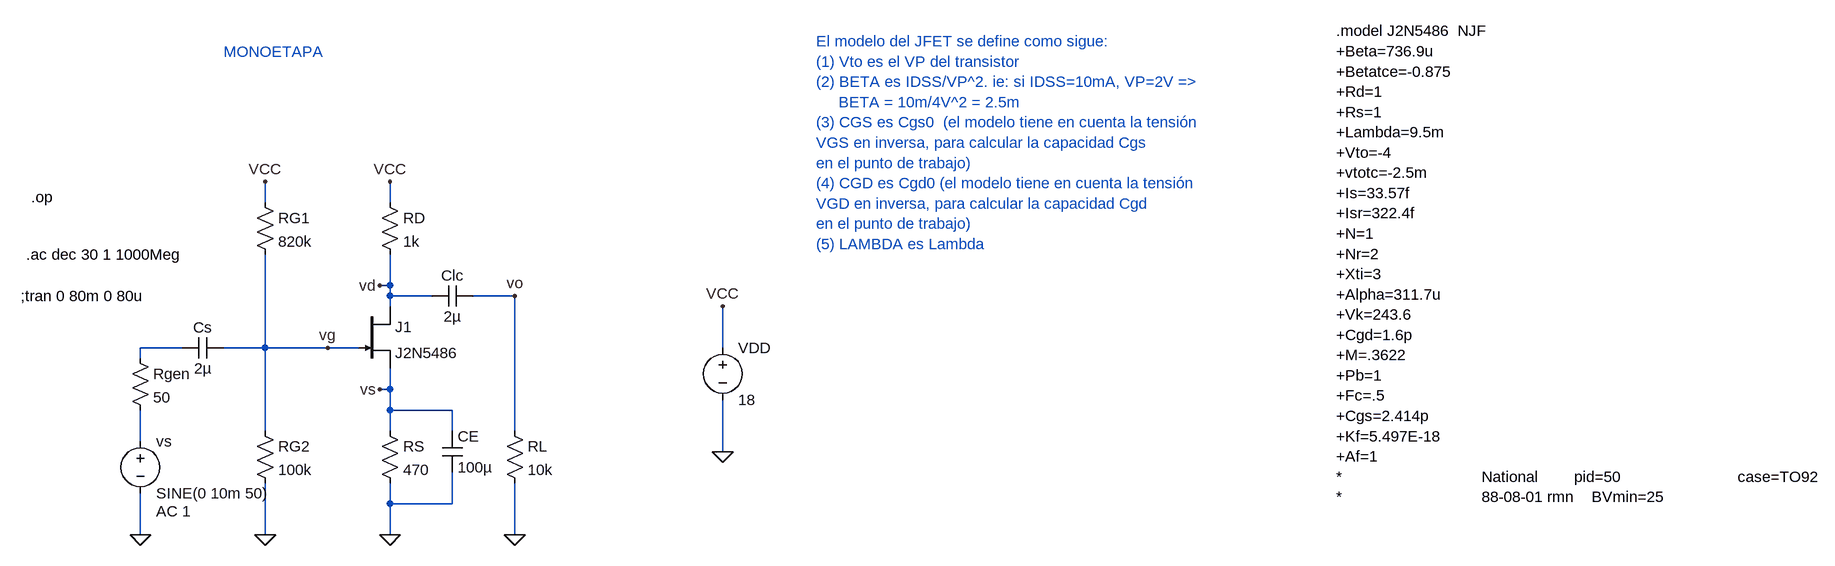
[diagram p0: schematic JFETN.asc]
JFETN.asc, the LTspice schematic file:
Version 4
SHEET 1 4420 924
WIRE 16 64 16 32
WIRE 208 64 208 32
WIRE 208 192 208 144
WIRE 208 192 192 192
WIRE 208 208 208 192
WIRE 272 208 208 208
WIRE 400 208 336 208
WIRE 208 224 208 208
WIRE -112 288 -176 288
WIRE 16 288 16 144
WIRE 16 288 -48 288
WIRE 112 288 16 288
WIRE 160 288 112 288
WIRE 720 288 720 224
WIRE -176 304 -176 288
WIRE 208 352 208 320
WIRE 208 352 192 352
WIRE 208 384 208 352
WIRE 304 384 208 384
WIRE 16 416 16 288
WIRE 208 416 208 384
WIRE 304 416 304 384
WIRE 400 416 400 208
WIRE -176 432 -176 384
WIRE 720 448 720 368
WIRE 208 528 208 496
WIRE 304 528 304 480
WIRE 304 528 208 528
WIRE -176 576 -176 512
WIRE 16 576 16 496
WIRE 208 576 208 528
WIRE 400 576 400 496
FLAG 112 288 vg
FLAG 192 352 vs
FLAG 192 192 vd
FLAG 16 576 0
FLAG 208 576 0
FLAG 400 576 0
FLAG 16 32 VCC
FLAG 208 32 VCC
FLAG 720 224 VCC
FLAG 720 448 0
FLAG -176 576 0
FLAG 400 208 vo
SYMBOL njf 160 224 R0
SYMATTR InstName J1
SYMATTR Value J2N5486
SYMBOL res 192 48 R0
SYMATTR InstName RD
SYMATTR Value 1k
SYMBOL res 192 400 R0
SYMATTR InstName RS
SYMATTR Value 470
SYMBOL res 0 48 R0
SYMATTR InstName RG1
SYMATTR Value 820k
SYMBOL res 0 400 R0
SYMATTR InstName RG2
SYMATTR Value 100k
SYMBOL cap 336 192 R90
WINDOW 0 0 32 VBottom 2
WINDOW 3 32 32 VTop 2
SYMATTR InstName Clc
SYMATTR Value 2µ
SYMBOL cap -48 272 R90
WINDOW 0 0 32 VBottom 2
WINDOW 3 32 32 VTop 2
SYMATTR InstName Cs
SYMATTR Value 2µ
SYMBOL res 384 400 R0
SYMATTR InstName RL
SYMATTR Value 10k
SYMBOL voltage 720 272 R0
SYMATTR InstName VDD
SYMATTR Value 18
SYMBOL voltage -176 416 R0
WINDOW 123 24 124 Left 2
WINDOW 39 0 0 Left 0
SYMATTR Value2 AC 1
SYMATTR InstName vs
SYMATTR Value SINE(0 10m 50)
SYMBOL cap 288 416 R0
SYMATTR InstName CE
SYMATTR Value 100µ
SYMBOL res -192 288 R0
SYMATTR InstName Rgen
SYMATTR Value 50
TEXT 864 -184 Left 2 ;El modelo del JFET se define como sigue:\n(1) Vto es el VP del transistor\n(2) BETA es IDSS/VP^2. ie: si IDSS=10mA, VP=2V =>\n     BETA = 10m/4V^2 = 2.5m\n(3) CGS es Cgs0  (el modelo tiene en cuenta la tensión \nVGS en inversa, para calcular la capacidad Cgs \nen el punto de trabajo)\n(4) CGD es Cgd0 (el modelo tiene en cuenta la tensión \nVGD en inversa, para calcular la capacidad Cgd \nen el punto de trabajo)\n(5) LAMBDA es Lambda
TEXT 1664 -200 Left 2 !.model J2N5486  NJF\n+Beta=736.9u\n+Betatce=-0.875\n+Rd=1\n+Rs=1\n+Lambda=9.5m\n+Vto=-4\n+vtotc=-2.5m\n+Is=33.57f\n+Isr=322.4f\n+N=1\n+Nr=2\n+Xti=3\n+Alpha=311.7u\n+Vk=243.6\n+Cgd=1.6p\n+M=.3622\n+Pb=1\n+Fc=.5\n+Cgs=2.414p\n+Kf=5.497E-18\n+Af=1\n*                               National        pid=50                          case=TO92\n*                               88-08-01 rmn    BVmin=25
TEXT -360 208 Left 2 !;tran 0 80m 0 80u
TEXT -352 144 Left 2 !.ac dec 30 1 1000Meg
TEXT -344 56 Left 2 !.op
TEXT -48 -168 Left 2 ;MONOETAPA

The netlist it stands for:
* JFETN.asc
J1 vd vg vs J2N5486
RD VCC vd 1k
RS vs 0 470
RG1 VCC vg 820k
RG2 vg 0 100k
Clc vo vd 2µ
Cs vg N001 2µ
RL vo 0 10k
VDD VCC 0 18
vs N002 0 SINE(0 10m 50) AC 1
CE vs 0 100µ
Rgen N001 N002 50
.model NJF NJF
.model PJF PJF
.lib standard.jft
* El modelo del JFET se define como sigue:
* (1) Vto es el VP del transistor
* (2) BETA es IDSS/VP^2. ie: si IDSS=10mA, VP=2V =>
*      BETA = 10m/4V^2 = 2.5m
* (3) CGS es Cgs0  (el modelo tiene en cuenta la tensión
* VGS en inversa, para calcular la capacidad Cgs
* en el punto de trabajo)
* (4) CGD es Cgd0 (el modelo tiene en cuenta la tensión
* VGD en inversa, para calcular la capacidad Cgd
* en el punto de trabajo)
* (5) LAMBDA es Lambda
.model J2N5486  NJF
+Beta=736.9u
+Betatce=-0.875
+Rd=1
+Rs=1
+Lambda=9.5m
+Vto=-4
+vtotc=-2.5m
+Is=33.57f
+Isr=322.4f
+N=1
+Nr=2
+Xti=3
+Alpha=311.7u
+Vk=243.6
+Cgd=1.6p
+M=.3622
+Pb=1
+Fc=.5
+Cgs=2.414p
+Kf=5.497E-18
+Af=1
*                               National        pid=50                          case=TO92
*                               88-08-01 rmn    BVmin=25
;tran 0 80m 0 80u
.ac dec 30 1 1000Meg
.op
* MONOETAPA
.backanno
.end